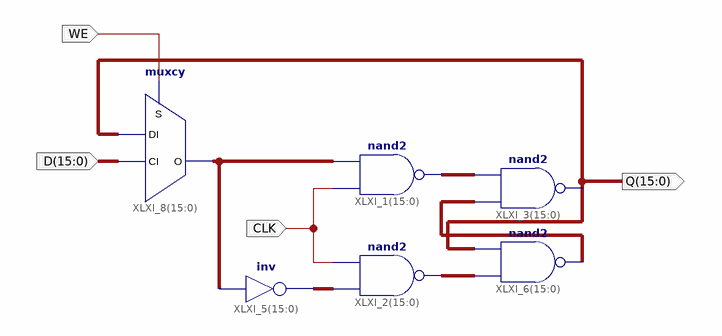
[diagram p0: schematic sheet 1]
// Xilinx ISE schematic dff_16bit.sch (spartan6) as structural Verilog: 6 symbols, 4 ports
module dff_16bit (
  input  CLK,
  input  [15:0] D,
  input  WE,
  output [15:0] Q
);

  wire [15:0] XLXN_17, XLXN_26, XLXN_27, XLXN_28, XLXN_37;

  assign XLXN_26 = ~({16{CLK}} & XLXN_37);  // nand2 XLXI_1[15..0], 16 bits wide
  assign XLXN_27 = ~(XLXN_17 & {16{CLK}});  // nand2 XLXI_2[15..0], 16 bits wide
  assign Q = ~(XLXN_28 & XLXN_26);  // nand2 XLXI_3[15..0], 16 bits wide
  assign XLXN_17 = ~XLXN_37;  // inv XLXI_5[15..0], 16 bits wide
  assign XLXN_28 = ~(XLXN_27 & Q);  // nand2 XLXI_6[15..0], 16 bits wide
  muxcy XLXI_8[15:0] (.CI(D), .DI(Q), .S(WE), .O(XLXN_37));
endmodule
